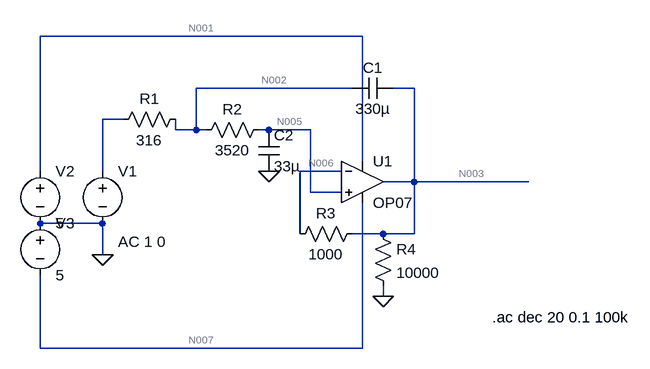
[diagram p0: schematic 2ndOrderLowPass.asc]
2ndOrderLowPass.asc, the LTspice schematic file:
Version 4
SHEET 1 880 680
WIRE 240 -48 -256 -48
WIRE 224 32 -16 32
WIRE 320 32 288 32
WIRE -128 80 -160 80
WIRE -48 96 -48 80
WIRE -16 96 -16 32
WIRE -16 96 -48 96
WIRE 0 96 -16 96
WIRE 96 96 80 96
WIRE 160 96 96 96
WIRE 240 144 240 -48
WIRE -256 160 -256 -48
WIRE -160 160 -160 80
WIRE 208 160 144 160
WIRE 320 176 320 32
WIRE 320 176 272 176
WIRE 496 176 320 176
WIRE 160 192 160 96
WIRE 208 192 160 192
WIRE -160 240 -256 240
WIRE 144 256 144 160
WIRE 272 256 224 256
WIRE 320 256 320 176
WIRE 320 256 272 256
WIRE -160 288 -160 240
WIRE 272 352 272 336
WIRE -256 432 -256 320
WIRE 240 432 240 208
WIRE 240 432 -256 432
FLAG 96 160 0
FLAG -160 288 0
FLAG 272 352 0
SYMBOL voltage -160 144 R0
WINDOW 123 24 124 Left 2
WINDOW 39 0 0 Left 2
SYMATTR Value2 AC 1 0
SYMATTR InstName V1
SYMATTR Value ""
SYMBOL voltage -256 144 R0
WINDOW 123 0 0 Left 2
WINDOW 39 0 0 Left 2
SYMATTR InstName V2
SYMATTR Value 5
SYMBOL res 96 80 R90
WINDOW 0 0 56 VBottom 2
WINDOW 3 32 56 VTop 2
SYMATTR InstName R2
SYMATTR Value 3520
SYMBOL cap 288 16 R90
WINDOW 0 0 32 VBottom 2
WINDOW 3 32 32 VTop 2
SYMATTR InstName C1
SYMATTR Value 330µ
SYMBOL res -32 64 R90
WINDOW 0 0 56 VBottom 2
WINDOW 3 32 56 VTop 2
SYMATTR InstName R1
SYMATTR Value 316
SYMBOL cap 80 96 R0
SYMATTR InstName C2
SYMATTR Value 33µ
SYMBOL voltage -256 224 R0
WINDOW 123 0 0 Left 2
WINDOW 39 0 0 Left 2
SYMATTR InstName V3
SYMATTR Value 5
SYMBOL res 240 240 R90
WINDOW 0 0 56 VBottom 2
WINDOW 3 32 56 VTop 2
SYMATTR InstName R3
SYMATTR Value 1000
SYMBOL res 256 240 R0
SYMATTR InstName R4
SYMATTR Value 10000
SYMBOL Opamps\\OP07 240 112 R0
SYMATTR InstName U1
TEXT 440 384 Left 2 !.ac dec 20 0.1 100k

The netlist it stands for:
* 2ndOrderLowPass.asc
V1 N004 0 AC 1 0
V2 N001 0 5
R2 N005 N002 3520
C1 N003 N002 330µ
R1 N002 N004 316
C2 N005 0 33µ
V3 0 N007 5
R3 N003 N006 1000
R4 N003 0 10000
XU1 N005 N006 N001 N007 N003 LT1001  ; OP07, pins In+ In- V+ V- OUT
.ac dec 20 0.1 100k
.lib LTC.lib
.backanno
.end

* Results of the author's LTspice run, read from the files saved beside the schematic
* Operating Point, zero values left out:
*   V(n001) = 5 V
*   V(n007) = -5 V
*   I(V3) = -2.25 mA
*   I(V2) = -2.25 mA
*   Ix(u1:3) = 2.25 mA
*   Ix(u1:4) = -2.25 mA
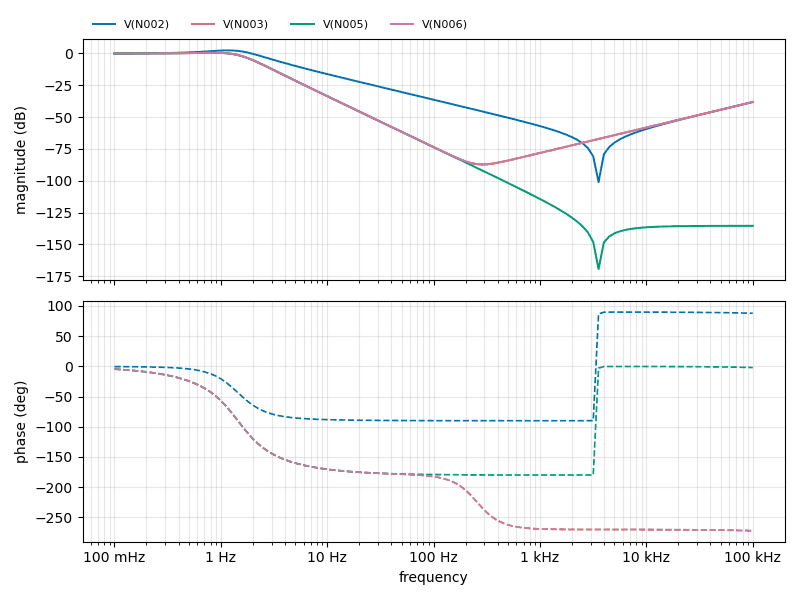
[diagram p1: AC Analysis of 2ndOrderLowPass.asc, plotted from the saved traces]
* AC Analysis, 1 run:
*   V(N002): 0.04 dB at 100 mHz, -38.11 dB at 100 kHz, peak 2.43 dB at 1.122 Hz, 3 dB below the peak at 2.054 Hz
*   V(N003): 0.01 dB at 100 mHz, -38.10 dB at 100 kHz, peak 0.52 dB at 794.3 mHz, 3 dB below the peak at 1.633 Hz
*   V(N005): 0.01 dB at 100 mHz, -135.37 dB at 100 kHz, peak 0.52 dB at 794.3 mHz, 3 dB below the peak at 1.633 Hz
*   V(N006): 0.01 dB at 100 mHz, -38.10 dB at 100 kHz, peak 0.52 dB at 794.3 mHz, 3 dB below the peak at 1.633 Hz